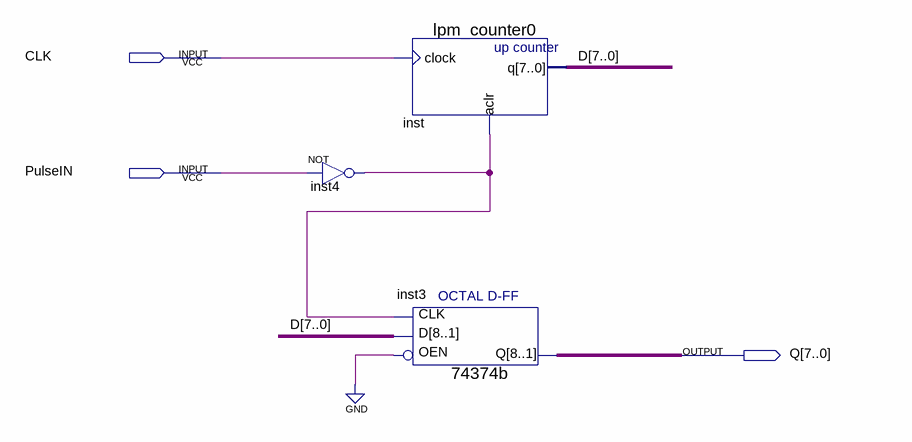
[diagram p0: schematic sheet]
// Quartus schematic PulseWidth_Mesurement.bdf as structural Verilog: 3 symbols, 3 pins
module PulseWidth_Mesurement (
  input  CLK,
  input  PulseIN,
  output [7:0] Q
);

  wire inst4_out;
  wire [7:0] D;

  not inst4 (inst4_out, PulseIN);
  lpm_counter0 inst (.clock(CLK), .aclr(inst4_out), .q(D));
  \74374b  inst3 (.D(D), .OEN(1'b0), .CLK(inst4_out), .Q(Q));
endmodule
